# Altium schematic sheet cs301_YourGroupNumber---------------.SchDoc
size A4; SheetNumber: 1; SheetTotal: 1
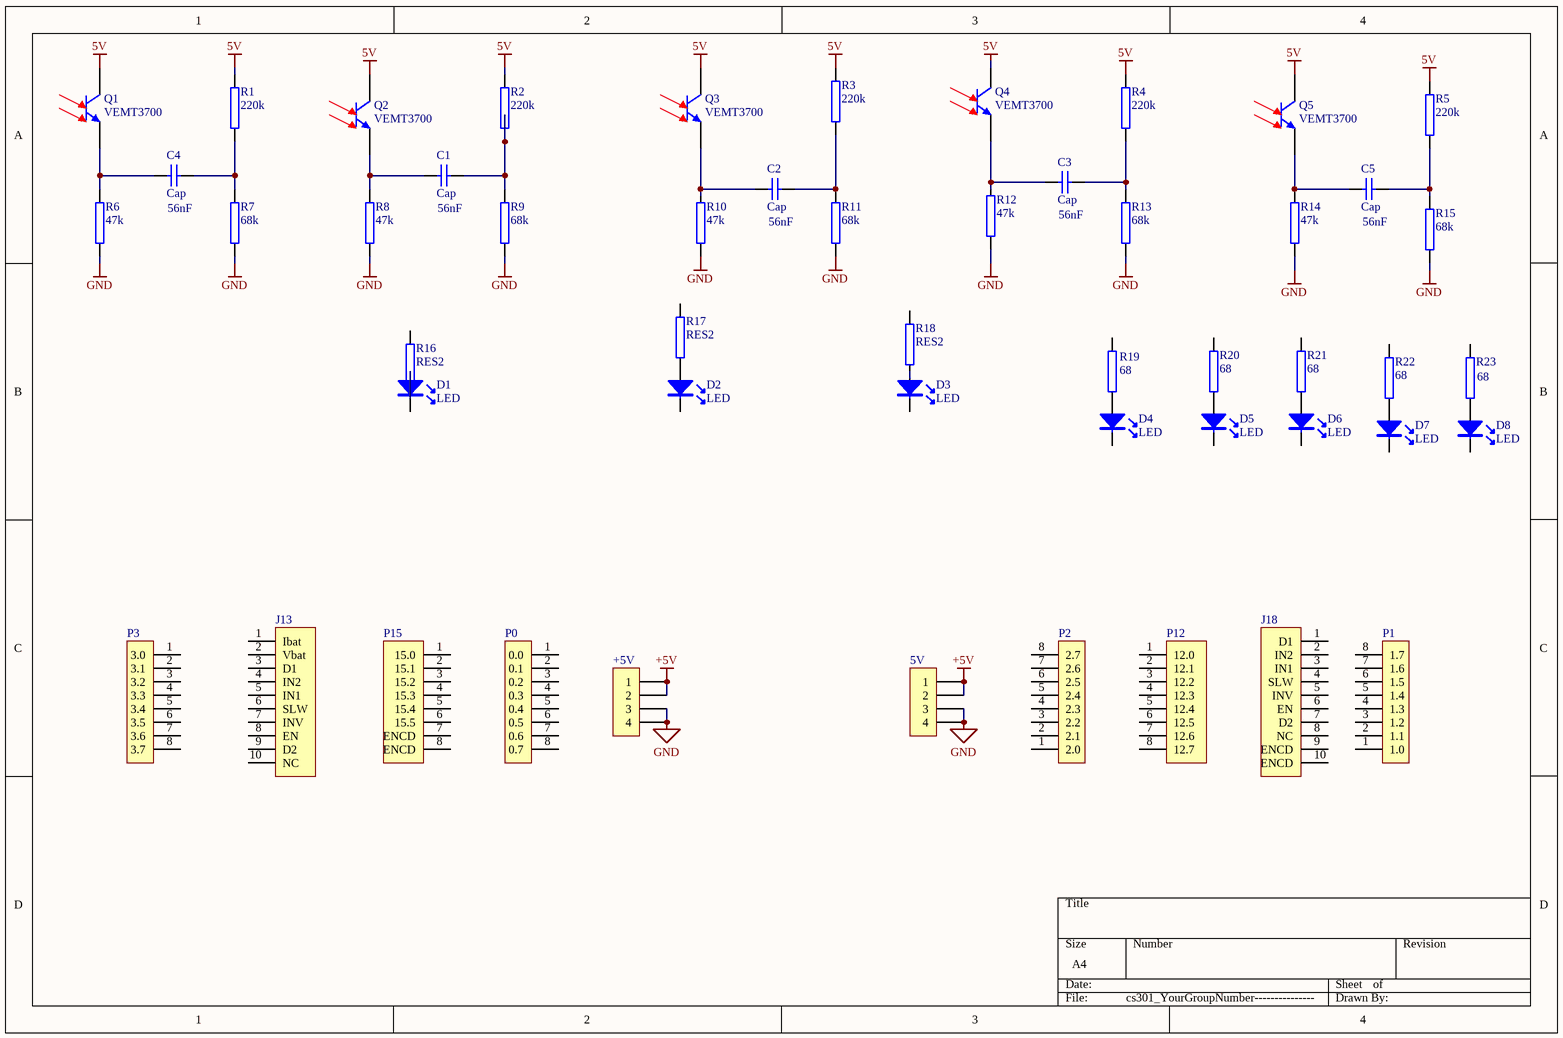
[diagram p0: cs301_YourGroupNumber---------------.SchDoc]

## Parts
5V  5V  [IDC4]  (value not drawn)
+5V  5V  [IDC4]  (value not drawn)
C1  Cap  value 56nF  [RAD-0.3]
C2  Cap  value 56nF  [RAD-0.3]
C3  Cap  value 56nF  [RAD-0.3]
C4  Cap  value 56nF  [RAD-0.3]
C5  Cap  value 56nF  [RAD-0.3]
D1  LED  [LED0.1/5MM]
D2  LED  [LED0.1/5MM]
D3  LED  [LED0.1/5MM]
D4  LED  [LED0.1/5MM]
D5  LED  [LED0.1/5MM]
D6  LED  [LED0.1/5MM]
D7  LED  [LED0.1/5MM]
D8  LED  [LED0.1/5MM]
J13  CON10  [idc10]  (value not drawn)
J18  CON10  [IDC10]  (value not drawn)
P0  P0  [idc8]  (value not drawn)
P1  P1  [idc8]  (value not drawn)
P2  P2  [idc8]  (value not drawn)
P3  P3  [idc8]  (value not drawn)
P12  P12  [idc8]  (value not drawn)
P15  P15  [idc8]  (value not drawn)
Q1  VEMT3700  [VEMT3700]
Q2  VEMT3700  [VEMT3700]
Q3  VEMT3700  [VEMT3700]
Q4  VEMT3700  [VEMT3700]
Q5  VEMT3700  [VEMT3700]
R1  220k  [AXIAL0.4]
R2  220k  [AXIAL0.4]
R3  220k  [AXIAL0.4]
R4  220k  [AXIAL0.4]
R5  220k  [AXIAL0.4]
R6  47k  [AXIAL0.4]
R7  68k  [AXIAL0.4]
R8  47k  [AXIAL0.4]
R9  68k  [AXIAL0.4]
R10  47k  [AXIAL0.4]
R11  68k  [AXIAL0.4]
R12  47k  [AXIAL0.4]
R13  68k  [AXIAL0.4]
R14  47k  [AXIAL0.4]
R15  68k  [AXIAL0.4]
R16  RES2  [AXIAL0.4]
R17  RES2  [AXIAL0.4]
R18  RES2  [AXIAL0.4]
R19  68  [AXIAL0.4]
R20  68  [AXIAL0.4]
R21  68  [AXIAL0.4]
R22  68  [AXIAL0.4]
R23  68  [AXIAL0.4]

## Nets
5V: Q1.1(C) Q2.1(C) Q3.1(C) Q4.1(C) Q5.1(C) R1.2 R2.2 R3.2 R4.2 R5.2
+5V: 5V.1 5V.2 +5V.1 +5V.2
GND: 5V.3 5V.4 +5V.3 +5V.4 R6.1 R7.1 R8.1 R9.1 R10.1 R11.1 R12.1 R13.1 R14.1 R15.1
NetC1_1: C1.1 Q2.2(E) R8.2
NetC1_2: C1.2 R2.1 R9.2
NetC2_1: C2.1 Q3.2(E) R10.2
NetC2_2: C2.2 R3.1 R11.2
NetC3_1: C3.1 Q4.2(E) R12.2
NetC3_2: C3.2 R4.1 R13.2
NetC4_1: C4.1 Q1.2(E) R6.2
NetC4_2: C4.2 R1.1 R7.2
NetC5_1: C5.1 Q5.2(E) R14.2
NetC5_2: C5.2 R5.1 R15.2
NetD1_A: D1.A R16.1
NetD2_A: D2.A R17.1
NetD3_A: D3.A R18.2
NetD4_A: D4.A R19.1
NetD5_A: D5.A R20.1
NetD6_A: D6.A R21.1
NetD7_A: D7.A R22.1
NetD8_A: D8.A R23.1

Not connected (* = marked no-connect by the designer): D1 K(2); D2 K(2); D3 K(2); D4 K(2); D5 K(2); D6 K(2); D7 K(2); D8 K(2); J13 1(Ibat) 2(Vbat) 3(D1) 4(IN2) 5(IN1) 6(SLW) 7(INV) 8(EN) 9(D2) 10(NC); J18 1(D1) 2(IN2) 3(IN1) 4(SLW) 5(INV) 6(EN) 7(D2) 8(NC) 9(ENCD) 10(ENCD); P0 1(0.0) 2(0.1) 3(0.2) 4(0.3) 5(0.4) 6(0.5) 7(0.6) 8(0.7); P1 1(1.0) 2(1.1) 3(1.2) 4(1.3) 5(1.4) 6(1.5) 7(1.6) 8(1.7); P2 1(2.0) 2(2.1) 3(2.2) 4(2.3) 5(2.4) 6(2.5) 7(2.6) 8(2.7); P3 1(3.0) 2(3.1) 3(3.2) 4(3.3) 5(3.4) 6(3.5) 7(3.6) 8(3.7); P12 1(12.0) 2(12.1) 3(12.2) 4(12.3) 5(12.4) 6(12.5) 7(12.6) 8(12.7); P15 1(15.0) 2(15.1) 3(15.2) 4(15.3) 5(15.4) 6(15.5) 7(ENCD) 8(ENCD); R16 2; R17 2; R18 1; R19 2; R20 2; R21 2; R22 2; R23 2

## Library data of the parts
5V +5V = CON4: Connector
C1-C5 = Cap: Capacitor; Published: 8-Jun-2000; LatestRevisionDate: 17-Jul-2002; LatestRevisionNote: Re-released for DXP Platform.; PackageReference: RAD-0.3; Publisher: Altium Limited; PackageDescription: Radial Cap, Thru-Hole; 2 Leads; 0.3 in Pin Spacing
J13 J18 = CON10: Connector
P0-P3 = CON8: Connector
P12 P15 = CON8_1: Connector
Q1-Q5 = VEMT3700: Silicon NPN Phototransistor
R1-R15 R19-R23 = RES2